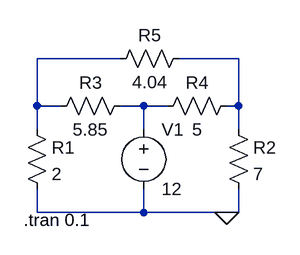
[diagram p0: schematic Draft10.asc]
Draft10.asc, the LTspice schematic file:
Version 4
SHEET 1 880 680
WIRE 160 48 48 48
WIRE 320 48 240 48
WIRE 48 112 48 48
WIRE 80 112 48 112
WIRE 192 112 160 112
WIRE 224 112 192 112
WIRE 320 112 320 48
WIRE 320 112 304 112
WIRE 48 144 48 112
WIRE 192 144 192 112
WIRE 320 144 320 112
WIRE 48 256 48 224
WIRE 192 256 192 224
WIRE 192 256 48 256
WIRE 304 256 192 256
WIRE 320 256 320 224
WIRE 320 256 304 256
FLAG 304 256 0
SYMBOL res 32 128 R0
SYMATTR InstName R1
SYMATTR Value 2
SYMBOL res 304 128 R0
SYMATTR InstName R2
SYMATTR Value 7
SYMBOL res 176 96 R90
WINDOW 0 0 56 VBottom 2
WINDOW 3 32 56 VTop 2
SYMATTR InstName R3
SYMATTR Value 5.85
SYMBOL res 320 96 R90
WINDOW 0 0 56 VBottom 2
WINDOW 3 32 56 VTop 2
SYMATTR InstName R4
SYMATTR Value 5
SYMBOL res 256 32 R90
WINDOW 0 0 56 VBottom 2
WINDOW 3 32 56 VTop 2
SYMATTR InstName R5
SYMATTR Value 4.04
SYMBOL voltage 192 128 R0
WINDOW 123 0 0 Left 2
WINDOW 39 0 0 Left 2
SYMATTR InstName V1
SYMATTR Value 12
TEXT 30 266 Left 2 !.tran 0.1

The netlist it stands for:
* Draft10.asc
R1 N001 0 2
R2 N002 0 7
R3 N003 N001 5.85
R4 N002 N003 5
R5 N002 N001 4.04
V1 N003 0 12
.tran 0.1
.backanno
.end